# EAGLE design CascaMesa (EAGLE 9.6.2)
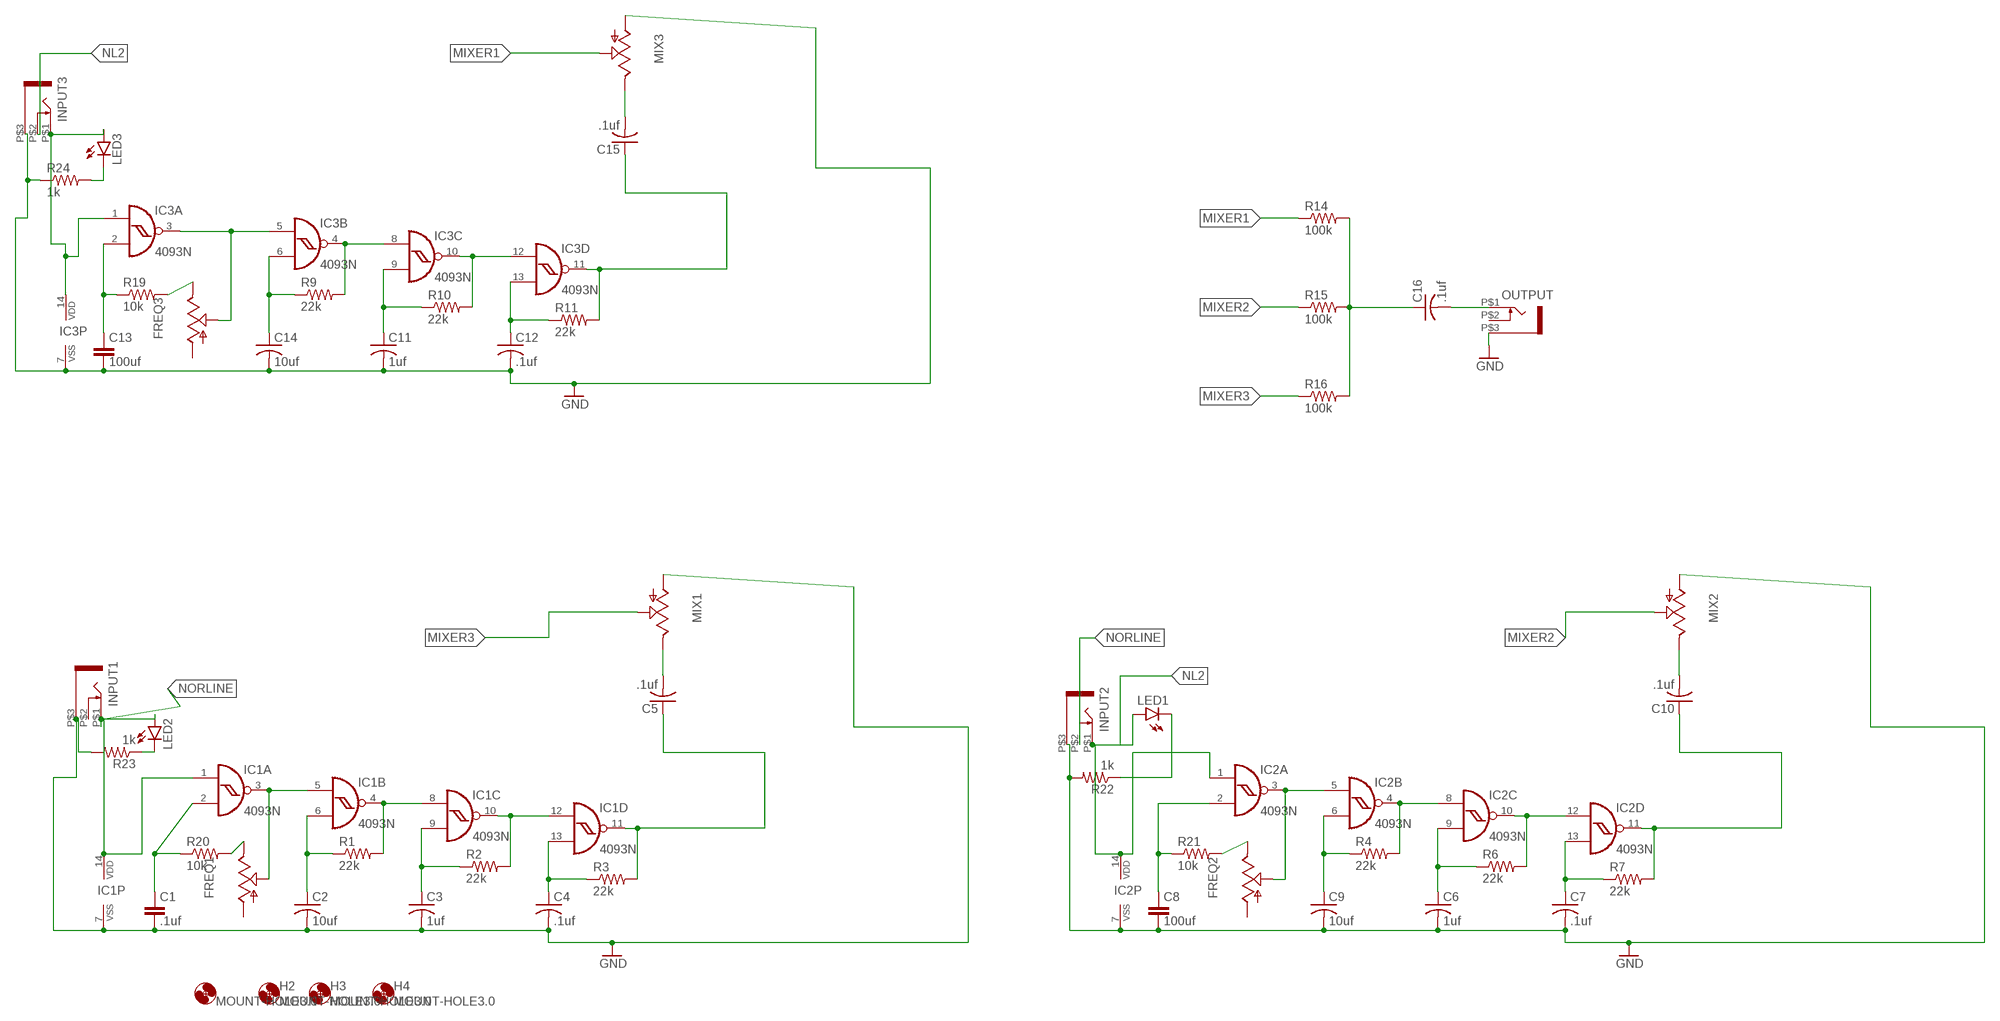
[diagram p0: schematic, sheet 1]

## Parts
C1  .1uf  C-EU050-025X075  [C050-025X075]
C2  10uf  C-US050-025X075  [C050-025X075]
C3  1uf  C-US050-025X075  [C050-025X075]
C4  .1uf  C-US050-025X075  [C050-025X075]
C5  .1uf  C-US050-025X075  [C050-025X075]
C6  1uf  C-US050-025X075  [C050-025X075]
C7  .1uf  C-US050-025X075  [C050-025X075]
C8  100uf  C-EU050-025X075  [C050-025X075]
C9  10uf  C-US050-025X075  [C050-025X075]
C10  .1uf  C-US050-025X075  [C050-025X075]
C11  1uf  C-US050-025X075  [C050-025X075]
C12  .1uf  C-US050-025X075  [C050-025X075]
C13  100uf  C-EU050-025X075  [C050-025X075]
C14  10uf  C-US050-025X075  [C050-025X075]
C15  .1uf  C-US050-025X075  [C050-025X075]
C16  .1uf  C-US050-025X075  [C050-025X075]
FREQ1  9MM_SNAP-IN_POT_  [9MM_SNAP-IN_POT]
FREQ2  9MM_SNAP-IN_POT_  [9MM_SNAP-IN_POT]
FREQ3  9MM_SNAP-IN_POT_  [9MM_SNAP-IN_POT]
H1  MOUNT-HOLE3.0  [3,0]
H2  MOUNT-HOLE3.0  [3,0]
H3  MOUNT-HOLE3.0  [3,0]
H4  MOUNT-HOLE3.0  [3,0]
IC1  4093N  [DIL14]
IC2  4093N  [DIL14]
IC3  4093N  [DIL14]
INPUT1  WQP-PJ301M-12_JACK  [WQP-PJ301M-12_JACK]
INPUT2  WQP-PJ301M-12_JACK  [WQP-PJ301M-12_JACK]
INPUT3  WQP-PJ301M-12_JACK  [WQP-PJ301M-12_JACK]
LED1  LED3MM  [LED3MM]
LED2  LED3MM  [LED3MM]
LED3  LED3MM  [LED3MM]
MIX1  9MM_SNAP-IN_POT_  [9MM_SNAP-IN_POT]
MIX2  9MM_SNAP-IN_POT_  [9MM_SNAP-IN_POT]
MIX3  9MM_SNAP-IN_POT_  [9MM_SNAP-IN_POT]
OUTPUT  WQP-PJ301M-12_JACK  [WQP-PJ301M-12_JACK]
R1  22k  R-US_0207/7  [0207/7]
R2  22k  R-US_0207/7  [0207/7]
R3  22k  R-US_0207/7  [0207/7]
R4  22k  R-US_0207/7  [0207/7]
R6  22k  R-US_0207/7  [0207/7]
R7  22k  R-US_0207/7  [0207/7]
R9  22k  R-US_0207/7  [0207/7]
R10  22k  R-US_0207/7  [0207/7]
R11  22k  R-US_0207/7  [0207/7]
R14  100k  R-US_0207/7  [0207/7]
R15  100k  R-US_0207/7  [0207/7]
R16  100k  R-US_0207/7  [0207/7]
R19  10k  R-US_0207/7  [0207/7]
R20  10k  R-US_0207/7  [0207/7]
R21  10k  R-US_0207/7  [0207/7]
R22  1k  R-US_0207/7  [0207/7]
R23  1k  R-US_0207/7  [0207/7]
R24  1k  R-US_0207/7  [0207/7]

## Nets
GND: C1.2 C2.2 C3.2 C4.2 C6.2 C7.2 C8.2 C9.2 C11.2 C12.2 C13.2 C14.2 IC1.7(P:VSS) IC2.7(P:VSS) IC3.7(P:VSS) INPUT1.P$3 INPUT2.P$3 INPUT3.P$3 MIX1.1(A) MIX2.1(A) MIX3.1(A) OUTPUT.P$3 R22.2 R23.2 R24.1
MIXER1: MIX3.2(S) R14.1
MIXER2: MIX2.2(S) R15.1
MIXER3: MIX1.2(S) R16.1
N$1: FREQ1.2(S) IC1.3(A:O) IC1.5(B:I0)
N$2: IC1.4(B:O) IC1.8(C:I0) R1.2
N$3: IC1.10(C:O) IC1.12(D:I0) R2.2
N$4: C1.1 IC1.2(A:I1) R20.1
N$5: C2.1 IC1.6(B:I1) R1.1
N$6: C3.1 IC1.9(C:I1) R2.1
N$7: C4.1 IC1.13(D:I1) R3.1
N$8: C5.2 MIX1.3(E)
N$9: C16.1 R14.2 R15.2 R16.2
N$10: C5.1 IC1.11(D:O) R3.2
N$11: LED1.K(C) R22.1
N$12: FREQ2.2(S) IC2.3(A:O) IC2.5(B:I0)
N$13: IC2.4(B:O) IC2.8(C:I0) R4.2
N$14: IC2.10(C:O) IC2.12(D:I0) R6.2
N$15: C8.1 IC2.2(A:I1) R21.1
N$16: C9.1 IC2.6(B:I1) R4.1
N$17: C6.1 IC2.9(C:I1) R6.1
N$19: C7.1 IC2.13(D:I1) R7.1
N$21: C16.2 OUTPUT.P$1
N$22: C10.1 IC2.11(D:O) R7.2
N$23: C10.2 MIX2.3(E)
N$25: FREQ3.2(S) IC3.3(A:O) IC3.5(B:I0)
N$26: IC3.4(B:O) IC3.8(C:I0) R9.2
N$27: IC3.10(C:O) IC3.12(D:I0) R10.2
N$28: C13.1 IC3.2(A:I1) R19.1
N$29: C14.1 IC3.6(B:I1) R9.1
N$30: C11.1 IC3.9(C:I1) R10.1
N$31: C12.1 IC3.13(D:I1) R11.1
N$32: LED2.K(C) R23.1
N$33: FREQ2.3(E) R21.2
N$34: C15.1 IC3.11(D:O) R11.2
N$35: C15.2 MIX3.3(E)
N$37: FREQ1.3(E) R20.2
N$39: IC3.1(A:I0) IC3.14(P:VDD) INPUT3.P$1 LED3.A
N$40: LED3.K(C) R24.2
N$41: FREQ3.3(E) R19.2
NL2: IC2.1(A:I0) IC2.14(P:VDD) INPUT2.P$1 INPUT3.P$2 LED1.A
NORLINE: IC1.1(A:I0) IC1.14(P:VDD) INPUT1.P$1 INPUT2.P$2 LED2.A
Unconnected: FREQ1.1(A) FREQ2.1(A) FREQ3.1(A) INPUT1.P$2 OUTPUT.P$2

## Library data of the parts
C1 C8 C13 = rcl:C-EU: CAPACITOR, European symbol; SPICEPREFIX: C
C2-C7 C9-C12 C14-C16 = rcl:C-US: CAPACITOR, American symbol; SPICEPREFIX: C
FREQ1-FREQ3 MIX1-MIX3 = MusicThingModular:9MM_SNAP-IN_POT: 9mm vertical snap-in pot, Alpha / Panasonic style
H1-H4 = holes:MOUNT-HOLE: MOUNTING HOLE with drill center marker
IC1-IC3 = 40xx:4093: Quad 2-input NAND schmitt trigger
INPUT1-INPUT3 OUTPUT = thonkiconn:WQP-PJ301M-12_JACK
LED1-LED3 = led:LED: LED OSRAM: - CHIPLED LG R971, LG N971, LY N971, LG Q971, LY Q971, LO R971, LY R971 LH N974, LH R974 LS Q976, LO Q976, LY Q976 LO Q996 - Hyper CHIPLED LW Q18S LB Q993, LB Q99A, LB R99A - SideLED LS A670, LO A670, LY A670, LG A670, LP A670 LB A673, LV A673, LT A673, LW A673 LH A674 LY A675 LS A676, LA A676, LO A676, LY A676, LW A676 LS A679, LY A679, LG A679 - Hyper Micro SIDELED® LS Y876, LA Y876, LO Y876, LY Y876 LT Y87S - SmartLED LW L88C, LW L88S LB L89C, LB L89S, LG L890 LS L89K, LO L89K, LY L89K LS L896, LA L896, LO L896, LY L896 - TOPLED LS T670, LO T670, LY T670, LG T670, LP T670 LSG T670, LSP T670, LSY T670, LOP T670, LYG T670 LG T671, LOG T671, LSG T671 LB T673, LV T673, LT T673, LW T673 LH T674 LS T676, LA T676, LO T676, LY T676, LB T676, LH T676, LSB T676, LW T676 LB T67C, LV T67C, LT T67C, LS T67K, LO T67K, LY T67K, LW E67C LS E67B, LA E67B, LO E67B, LY E67B, LB E67C, LV E67C, LT E67C LW T67C LS T679, LY T679, LG T679 LS T770, LO T770, LY T770, LG T770, LP T770 LB T773, LV T773, LT T773, LW T773 LH T774 LS E675, LA E675, LY E675, LS T675 LS T776, LA T776, LO T776, LY T776, LB T776 LHGB T686 LT T68C, LB T68C - Hyper Mini TOPLED® LB M676 - Mini TOPLED Santana® LG M470 LS M47K, LO M47K, LY M47K Source: http://www.osram.convergy.de LUXEON: - LUMILED® LXK2-PW12-R00, LXK2-PW12-S00, LXK2-PW14-U00, LXK2-PW14-V00 LXK2-PM12-R00, LXK2-PM12-S00, LXK2-PM14-U00 LXK2-PE12-Q00, LXK2-PE12-R00, LXK2-PE12-S00, LXK2-PE14-T00, LXK2-PE14-U00 LXK2-PB12-K00, LXK2-PB12-L00, LXK2-PB12-M00, LXK2-PB14-N00, LXK2-PB14-P00, LXK2-PB14-Q00 LXK2-PR12-L00, LXK2-PR12-M00, LXK2-PR14-Q00, LXK2-PR14-R00 LXK2-PD12-Q00, LXK2-PD12-R00, LXK2-PD12-S00 LXK2-PH12-R00, LXK2-PH12-S00 LXK2-PL12-P00, LXK2-PL12-Q00, LXK2-PL12-R00 Source: www.luxeon.com KINGBRIGHT: KA-3528ASYC Source: www.kingbright.com
R1-R4 R6 R7 R9-R11 R14-R16 R19-R24 = rcl:R-US_: RESISTOR, American symbol; SPICEPREFIX: R

## Board
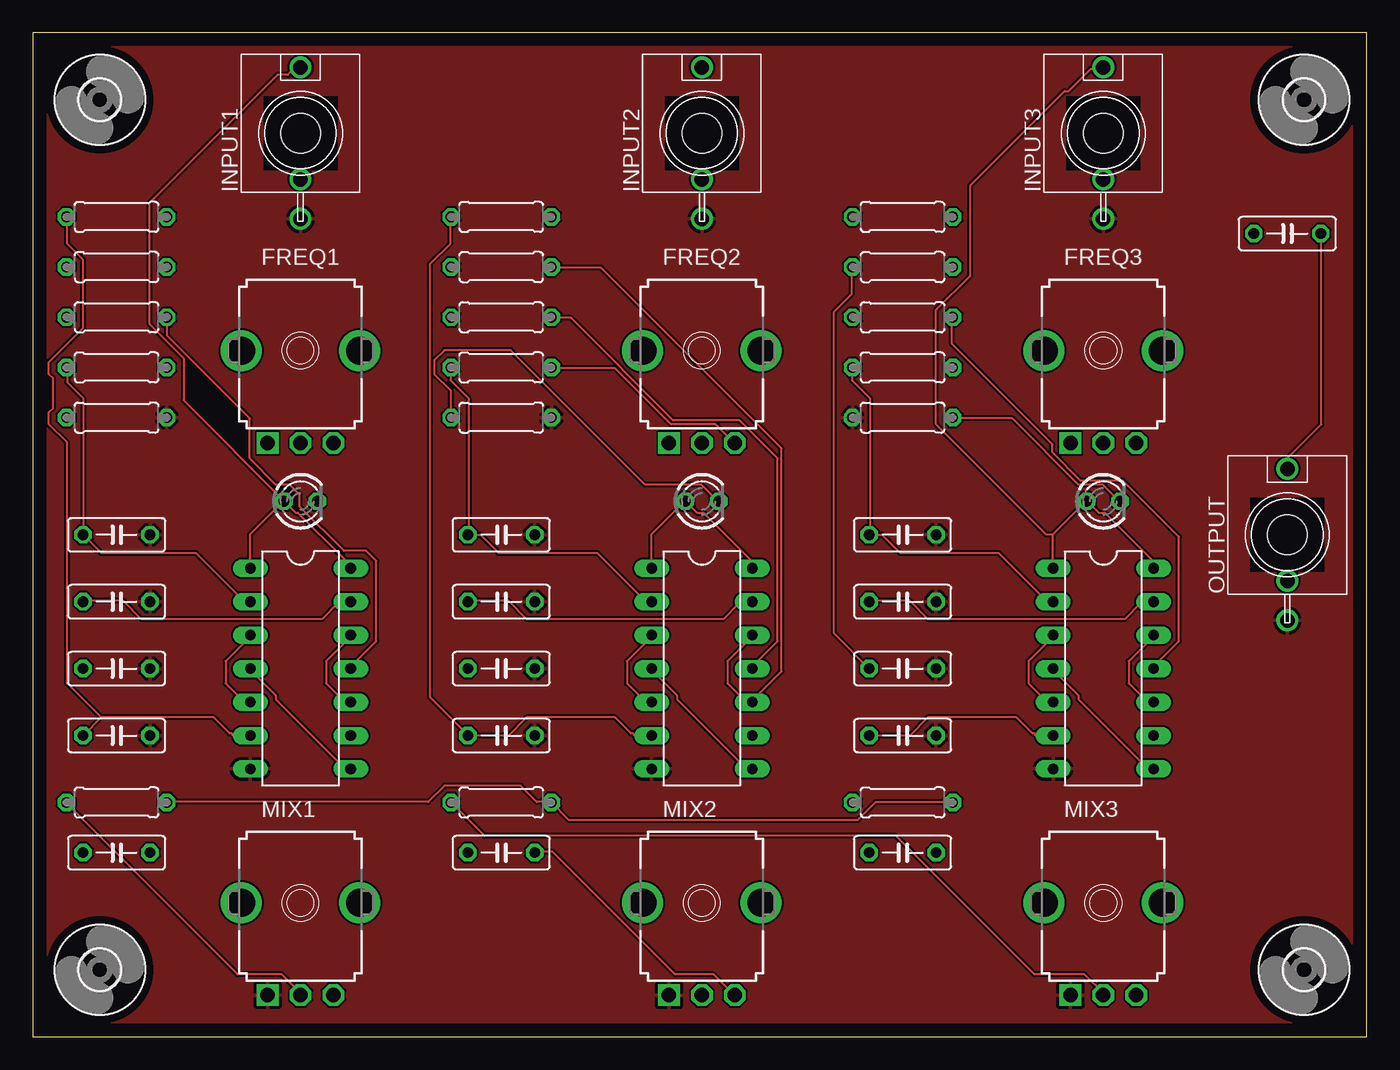
[diagram p1: board, top side]
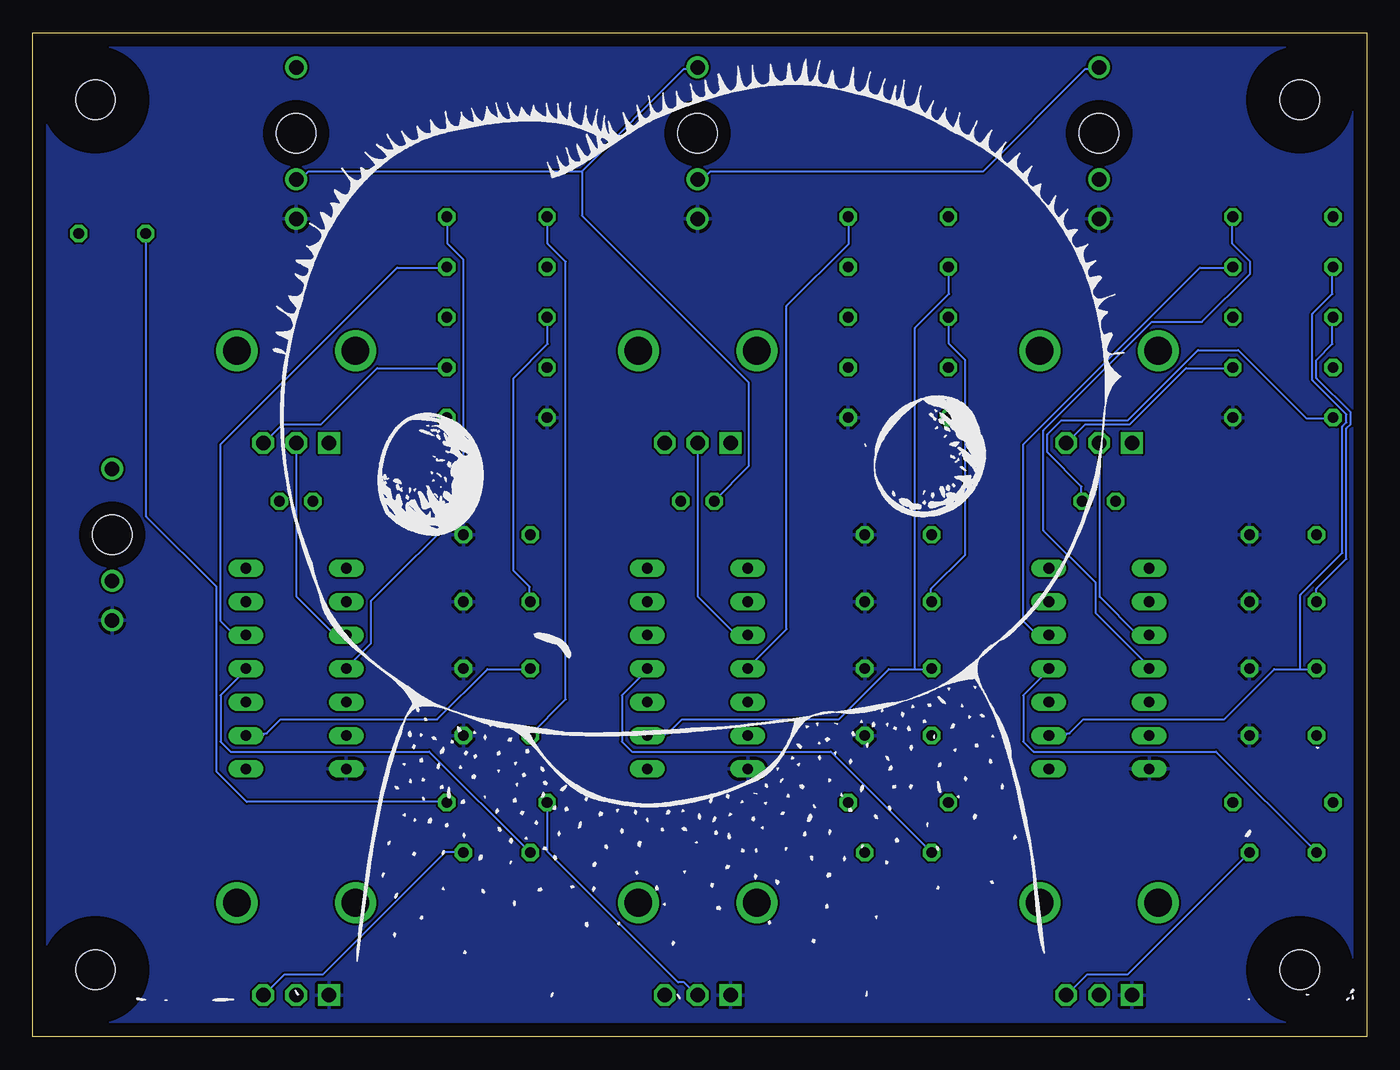
[diagram p2: board, bottom side, seen from below]

Size 101.27 x 76.19 mm. Coordinates in mm from the lower left corner, seen from the top.
Outline: 0,0 101.27,0 101.27,76.19 0,76.19 0,0
Copper layers (1*16): Top 0.035mm / dielectric 1.5mm / Bottom 0.035mm
Design rules "default": minimum track width 6mil, minimum drill 0.35mm, track to track 6mil, track to pad 6mil, pad to pad 6mil, via to via 6mil, smd to smd 6mil, copper to edge 40mil, drill to drill 6mil, minimum pad ring 10mil, minimum via ring 8mil, stop-mask expansion 4mil, vias tented up to drill 0mil, thermal gap 10mil
Holes 3 mm at 20.32,68.58 50.8,68.58 81.28,68.58 95.25,38.1

### Footprints (pad centres in the part's own frame; a part is rotated, then mirrored left to right if it is on the bottom)
C050-025X075 = drill 0.813 octagon: 1 -2.54,0; 2 2.54,0
9MM_SNAP-IN_POT = drill 1.1 square: 1 -2.5,-7 | drill 1.1 octagon: 2 0,-7; 3 2.5,-7 | drill 2.1 pad 2.794: CHASSIS1 -4.5,0; CHASSIS2 4.5,0
3,0 = hole 3: 0,0
DIL14 = drill 0.813 long: 1 -7.62,-3.81; 2 -5.08,-3.81; 3 -2.54,-3.81; 4 0,-3.81; 5 2.54,-3.81; 6 5.08,-3.81; 7 7.62,-3.81; 8 7.62,3.81; 9 5.08,3.81; 10 2.54,3.81; 11 0,3.81; 12 -2.54,3.81; 13 -5.08,3.81; 14 -7.62,3.81
WQP-PJ301M-12_JACK = drill 1.1: P$1 0,5; P$2 0,-3.5; P$3 0,-6.5
LED3MM = drill 0.813 octagon: A -1.27,0; K 1.27,0
0207/7 = drill 0.813 octagon: 1 -3.81,0; 2 3.81,0

### Placement (x,y rotation side)
C1  6.35,38.1 0 top
C2  6.35,22.86 0 top
C3  6.35,27.94 0 top
C4  6.35,33.02 0 top
C5  6.35,13.97 0 top
C6  35.56,27.94 0 top
C7  35.56,33.02 0 top
C8  35.56,38.1 0 top
C9  35.56,22.86 0 top
C10  35.56,13.97 0 top
C11  66.04,27.94 0 top
C12  66.04,33.02 0 top
C13  66.04,38.1 0 top
C14  66.04,22.86 0 top
C15  66.04,13.97 0 top
C16  95.25,60.96 0 top
FREQ1  20.32,52.07 0 top
FREQ2  50.8,52.07 0 top
FREQ3  81.28,52.07 0 top
H1  96.52,71.12 0 top
H2  96.52,5.08 0 top
H3  5.08,5.08 0 top
H4  5.08,71.12 0 top
IC1  20.32,27.94 270 top
IC2  50.8,27.94 270 top
IC3  81.28,27.94 270 top
INPUT1  20.32,68.58 0 top
INPUT2  50.8,68.58 0 top
INPUT3  81.28,68.58 0 top
LED1  50.8,40.64 0 top
LED2  20.32,40.64 0 top
LED3  81.28,40.64 0 top
MIX1  20.32,10.16 0 top
MIX2  50.8,10.16 0 top
MIX3  81.28,10.16 0 top
OUTPUT  95.25,38.1 0 top
R1  6.35,62.23 0 top
R2  6.35,58.42 0 top
R3  6.35,54.61 0 top
R4  35.56,62.23 0 top
R6  35.56,58.42 0 top
R7  35.56,54.61 0 top
R9  66.04,62.23 0 top
R10  66.04,58.42 0 top
R11  66.04,54.61 0 top
R14  35.56,17.78 0 top
R15  66.04,17.78 0 top
R16  6.35,17.78 0 top
R19  66.04,50.8 0 top
R20  6.35,50.8 0 top
R21  35.56,50.8 0 top
R22  35.56,46.99 0 top
R23  6.35,46.99 0 top
R24  66.04,46.99 0 top

### Tracks (layer width: path | path; a pad name or v marks a point on that pad's centre or on a via)
GND
  pour Top: 0,76.2 101.6,76.2 101.6,0 0,0
  pour Bottom: 0,76.2 101.6,76.2 101.6,0 0,0
MIXER1
  Top 0.152: R14.1 34.29,15.24 65.53,15.24 76.05,4.72 79.86,4.72 81.38,3.2 MIX3.2
MIXER2
  Bottom 0.152: R15.1 62.18,17.68 62.18,14.02 52.27,4.12 51.82,4.12 50.9,3.2 MIX2.2
MIXER3
  Top 0.152: R16.1 2.59,17.68 15.54,4.72 18.9,4.72 20.42,3.2 MIX1.2
N$1
  Top 0.152: IC1.5 16.46,25.45 16,25.45 14.63,26.82 14.63,28.5 16.61,30.48 IC1.3
  Bottom 0.152: IC1.3 17.37,30.48 20.27,33.38 20.27,44.96 FREQ1.2
N$2
  Top 0.152: IC1.8 24.08,20.42 23.62,20.42 18.44,25.6 18.44,25.91 16.46,27.89 IC1.4
  Bottom 0.152: R1.2 10.21,62.18 10.21,60.2 8.84,58.83 8.84,57.91 12.5,54.25 16.31,54.25 24.54,46.02 24.54,38.41 20.57,34.44 20.57,32.16 16.46,28.04 IC1.4
N$3
  Top 0.152: IC1.10 24.08,25.45 23.62,25.45 22.25,26.82 22.25,28.5 24.23,30.48 IC1.12
  Bottom 0.152: IC1.12 24.99,30.48 26.06,31.55 26.06,44.96 12.65,58.37 10.21,58.37 R2.2
N$4
  Top 0.152: R20.1 2.59,50.75 2.59,49.68 3.81,48.46 C1.1 5.18,36.73 12.34,36.73 16,33.07 16.46,33.07 IC1.2
N$5
  Top 0.152: 5.18,24.23 C2.1 | 5.18,24.23 13.72,24.23 14.94,23.01 15.09,23.01 15.24,22.86 IC1.6 | 5.18,24.23 2.59,26.82 2.59,45.11 1.22,46.48 1.22,47.4 1.52,47.7 1.52,49.99 1.22,50.29 1.22,51.21 3.81,53.8 3.81,58.98 2.59,60.2 2.59,62.18 R1.1
N$6
  Bottom 0.152: 5.03,27.89 7.01,27.89 10.82,24.08 21.49,24.08 22.55,23.01 22.71,23.01 22.86,22.86 IC1.9 | 5.03,27.89 3.81,27.89 C3.1 | 5.03,27.89 5.03,33.53 1.83,36.73 1.83,46.33 1.52,46.63 1.52,47.24 4.12,49.84 4.12,54.86 2.59,56.39 2.59,58.37 R2.1
N$7
  Top 0.152: C4.1 3.81,33.07 6.86,33.07 8.23,31.7 21.95,31.7 23.16,32.92 24.08,32.92 IC1.13
  Bottom 0.152: C4.1 3.81,33.98 1.52,36.27 1.52,46.18 1.22,46.48 1.22,47.4 3.81,49.99 3.81,51.36 2.59,52.58 2.59,54.56 R3.1
N$8
  Bottom 0.152: C5.2 18.14,4.72 21.18,4.72 22.71,3.2 MIX1.3
N$9
  Top 0.152: R16.2 10.21,17.83 30.02,17.83 31.24,19.05 37.03,19.05 38.25,17.83 39.32,17.83 R14.2 40.69,16.46 62.64,16.46 64.01,17.83 69.8,17.83 R15.2
  Bottom 0.152: C16.1 92.66,60.96 92.66,39.47 87.33,34.14 87.33,20.12 85.04,17.83 69.95,17.83 R15.2
N$10
  Top 0.152: R3.2 10.21,54.56 10.21,53.19 16.46,46.94 16.46,43.89 18.44,41.91 19.51,41.91 20.27,41.15 20.27,40.23 23.62,36.88 25.3,36.88 26.06,36.12 26.06,30.02 24.08,28.04 IC1.11
  Bottom 0.152: C5.1 3.81,14.02 11.43,21.64 25.3,21.64 26.06,22.4 26.06,25.91 24.08,27.89 IC1.11
N$11
  Top 0.152: R22.1 31.7,47.09 31.7,49.07 30.48,50.29 30.48,51.36 31.24,52.12 36.27,52.12 46.48,41.91 50.75,41.91 51.97,40.69 LED1.K
N$12
  Top 0.152: IC2.5 46.94,25.45 46.48,25.45 45.11,26.82 45.11,28.5 47.09,30.48 IC2.3
  Bottom 0.152: IC2.3 47.85,30.48 50.75,33.38 50.75,44.96 FREQ2.2
N$13
  Top 0.152: IC2.8 54.56,20.42 54.1,20.42 48.92,25.6 48.92,25.91 46.94,27.89 IC2.4
  Bottom 0.152: R4.2 39.32,62.18 39.32,60.2 44.04,55.47 44.04,30.94 46.94,28.04 IC2.4
N$14
  Top 0.152: 54.56,25.45 54.1,25.45 52.73,26.82 52.73,28.5 54.71,30.48 IC2.12 | 54.56,25.45 56.84,27.74 56.84,44.65 43.13,58.37 39.47,58.37 R6.2 | 54.56,25.45 IC2.10
N$15
  Top 0.152: 33.07,38.1 33.07,48.46 31.7,49.84 31.7,50.75 R21.1 | 33.07,38.1 33.98,38.1 35.36,36.73 42.82,36.73 46.48,33.07 46.94,33.07 IC2.2 | 33.07,38.1 C8.1
N$16
  Top 0.152: 33.07,22.86 36.12,22.86 37.49,24.23 44.2,24.23 45.41,23.01 45.57,23.01 45.72,22.86 IC2.6 | 33.07,22.86 30.18,25.76 30.18,58.67 31.7,60.2 31.7,62.18 R4.1 | 33.07,22.86 C9.1
N$17
  Bottom 0.152: 34.29,27.89 36.27,27.89 40.08,24.08 51.97,24.08 53.03,23.01 53.19,23.01 53.34,22.86 IC2.9 | 34.29,27.89 33.07,27.89 C6.1 | 34.29,27.89 34.29,53.8 31.7,56.39 31.7,58.37 R6.1
N$19
  Top 0.152: C7.1 33.07,33.07 36.12,33.07 37.49,31.7 52.43,31.7 53.65,32.92 54.56,32.92 IC2.13
  Bottom 0.152: R7.1 31.7,54.56 31.7,52.58 30.48,51.36 30.48,36.58 33.07,33.98 33.07,33.07 C7.1
N$21
  Top 0.152: OUTPUT.P$1 95.25,43.89 97.84,46.48 97.84,60.96 C16.2
N$22
  Top 0.152: R7.2 39.47,54.56 40.84,54.56 48.62,46.79 53.65,46.79 56.54,43.89 56.54,30.02 54.56,28.04 IC2.11
  Bottom 0.152: C10.1 40.69,21.64 55.78,21.64 56.54,22.4 56.54,25.91 54.56,27.89 IC2.11
N$23
  Top 0.152: C10.2 38.1,14.02 39.47,14.02 48.77,4.72 51.66,4.72 53.19,3.2 MIX2.3
N$25
  Top 0.152: IC3.5 77.42,25.45 76.96,25.45 75.59,26.82 75.59,28.5 77.57,30.48 IC3.3
  Bottom 0.152: IC3.3 78.33,30.48 81.23,33.38 81.23,44.96 FREQ3.2
N$26
  Top 0.152: IC3.8 85.04,20.42 84.58,20.42 79.4,25.6 79.4,25.91 77.42,27.89 IC3.4
  Bottom 0.152: R9.2 69.8,62.18 69.8,60.2 68.58,58.98 68.58,40.08 75.59,33.07 75.59,29.87 77.42,28.04 IC3.4
N$27
  Top 0.152: IC3.10 85.04,25.45 84.58,25.45 83.21,26.82 83.21,28.5 85.19,30.48 IC3.12
  Bottom 0.152: IC3.12 85.95,30.48 87.02,31.55 87.02,44.96 73.61,58.37 69.95,58.37 R10.2
N$28
  Top 0.152: 63.55,38.1 63.55,48.46 62.18,49.84 62.18,50.75 R19.1 | 63.55,38.1 64.47,38.1 65.84,36.73 73.3,36.73 76.96,33.07 77.42,33.07 IC3.2 | 63.55,38.1 C13.1
N$29
  Top 0.152: C14.1 66.6,22.86 67.97,24.23 74.68,24.23 75.89,23.01 76.05,23.01 76.2,22.86 IC3.6
  Bottom 0.152: R9.1 62.18,62.18 62.18,60.2 60.81,58.83 60.81,25.6 63.55,22.86 C14.1
N$30
  Top 0.152: C11.1 60.81,30.63 60.81,55.02 62.18,56.39 62.18,58.37 R10.1
  Bottom 0.152: IC3.9 83.82,22.86 83.67,23.01 83.52,23.01 82.45,24.08 70.56,24.08 66.75,27.89 63.55,27.89 C11.1
N$31
  Top 0.152: C12.1 63.55,33.07 66.6,33.07 67.97,31.7 82.91,31.7 84.12,32.92 85.04,32.92 IC3.13
  Bottom 0.152: R11.1 62.18,54.56 62.18,52.58 64.77,49.99 64.77,35.36 63.55,34.14 63.55,33.07 C12.1
N$32
  Bottom 0.152: R23.1 2.59,46.94 4.57,46.94 9.75,52.12 12.8,52.12 18.14,46.79 23.16,46.79 24.23,45.72 24.23,44.35 21.64,41.76 21.64,40.69 LED2.K
N$33
  Top 0.152: R21.2 39.47,50.75 44.2,50.75 48.46,46.48 51.82,46.48 53.19,45.11 FREQ2.3
N$34
  Top 0.152: R11.2 69.8,54.56 69.8,52.58 77.42,44.96 77.42,44.35 79.55,42.22 82.75,42.22 87.02,37.95 87.02,30.02 85.04,28.04 IC3.11
  Bottom 0.152: C15.1 71.17,21.64 86.26,21.64 87.02,22.4 87.02,25.91 85.04,27.89 IC3.11
N$35
  Bottom 0.152: C15.2 68.58,14.02 69.95,14.02 79.25,4.72 82.14,4.72 83.67,3.2 MIX3.3
N$37
  Bottom 0.152: R20.2 10.21,50.75 13.72,50.75 17.98,46.48 21.34,46.48 22.71,45.11 FREQ1.3
N$39
  Top 0.152: 77.42,38.1 77.42,35.66 IC3.1 | 80.01,40.69 77.42,38.1 | 80.01,40.69 80.92,39.78 81.38,39.78 85.04,36.12 85.04,35.66 IC3.14 | 80.01,40.69 LED3.A | 77.42,38.1 76.96,38.1 68.58,46.48 68.58,55.17 71.17,57.76 71.17,64.62 78.33,71.78 78.64,71.78 80.31,73.46 81.23,73.46 INPUT3.P$1
N$40
  Top 0.152: R24.2 69.95,46.94 74.37,46.94 79.4,41.91 81.23,41.91 82.45,40.69 LED3.K
N$41
  Bottom 0.152: R19.2 69.95,50.75 75.13,50.75 79.4,46.48 82.3,46.48 83.67,45.11 FREQ3.3
NL2
  Top 0.152: 49.53,40.69 46.94,38.1 46.94,35.66 IC2.1 | 49.53,40.69 50.44,39.78 50.9,39.78 54.56,36.12 54.56,35.66 IC2.14 | 49.53,40.69 LED1.A
  Bottom 0.152: 59.59,65.68 51.82,73.46 50.9,73.46 INPUT2.P$1 | 59.59,65.68 80.31,65.68 80.77,65.23 81.23,65.23 INPUT3.P$2 | 59.59,65.68 59.59,62.33 46.94,49.68 46.94,43.28 49.53,40.69 LED1.A
NORLINE
  Top 0.152: 19.05,40.69 16.46,38.1 16.46,35.66 IC1.1 | 19.05,40.69 19.96,39.78 20.12,39.78 23.62,36.27 23.62,36.12 24.08,35.66 IC1.14 | 19.05,40.69 11.43,48.31 11.43,51.51 8.84,54.1 8.84,63.25 18.59,73 19.36,73 19.81,73.46 20.27,73.46 INPUT1.P$1 | 19.05,40.69 LED2.A
  Bottom 0.152: INPUT1.P$1 20.42,73.46 21.34,73.46 29.11,65.68 49.84,65.68 50.29,65.23 50.75,65.23 INPUT2.P$2

### Text on the board
tValues: 100k | 100k | 100k | 100k | 100k | .1uf | .1uf | .1uf | VF | CascaMesa | 100k | 100k | 100k